# Altium schematic sheet PC104.SchDoc
size A3; SheetNumber: 8; SheetTotal: 8
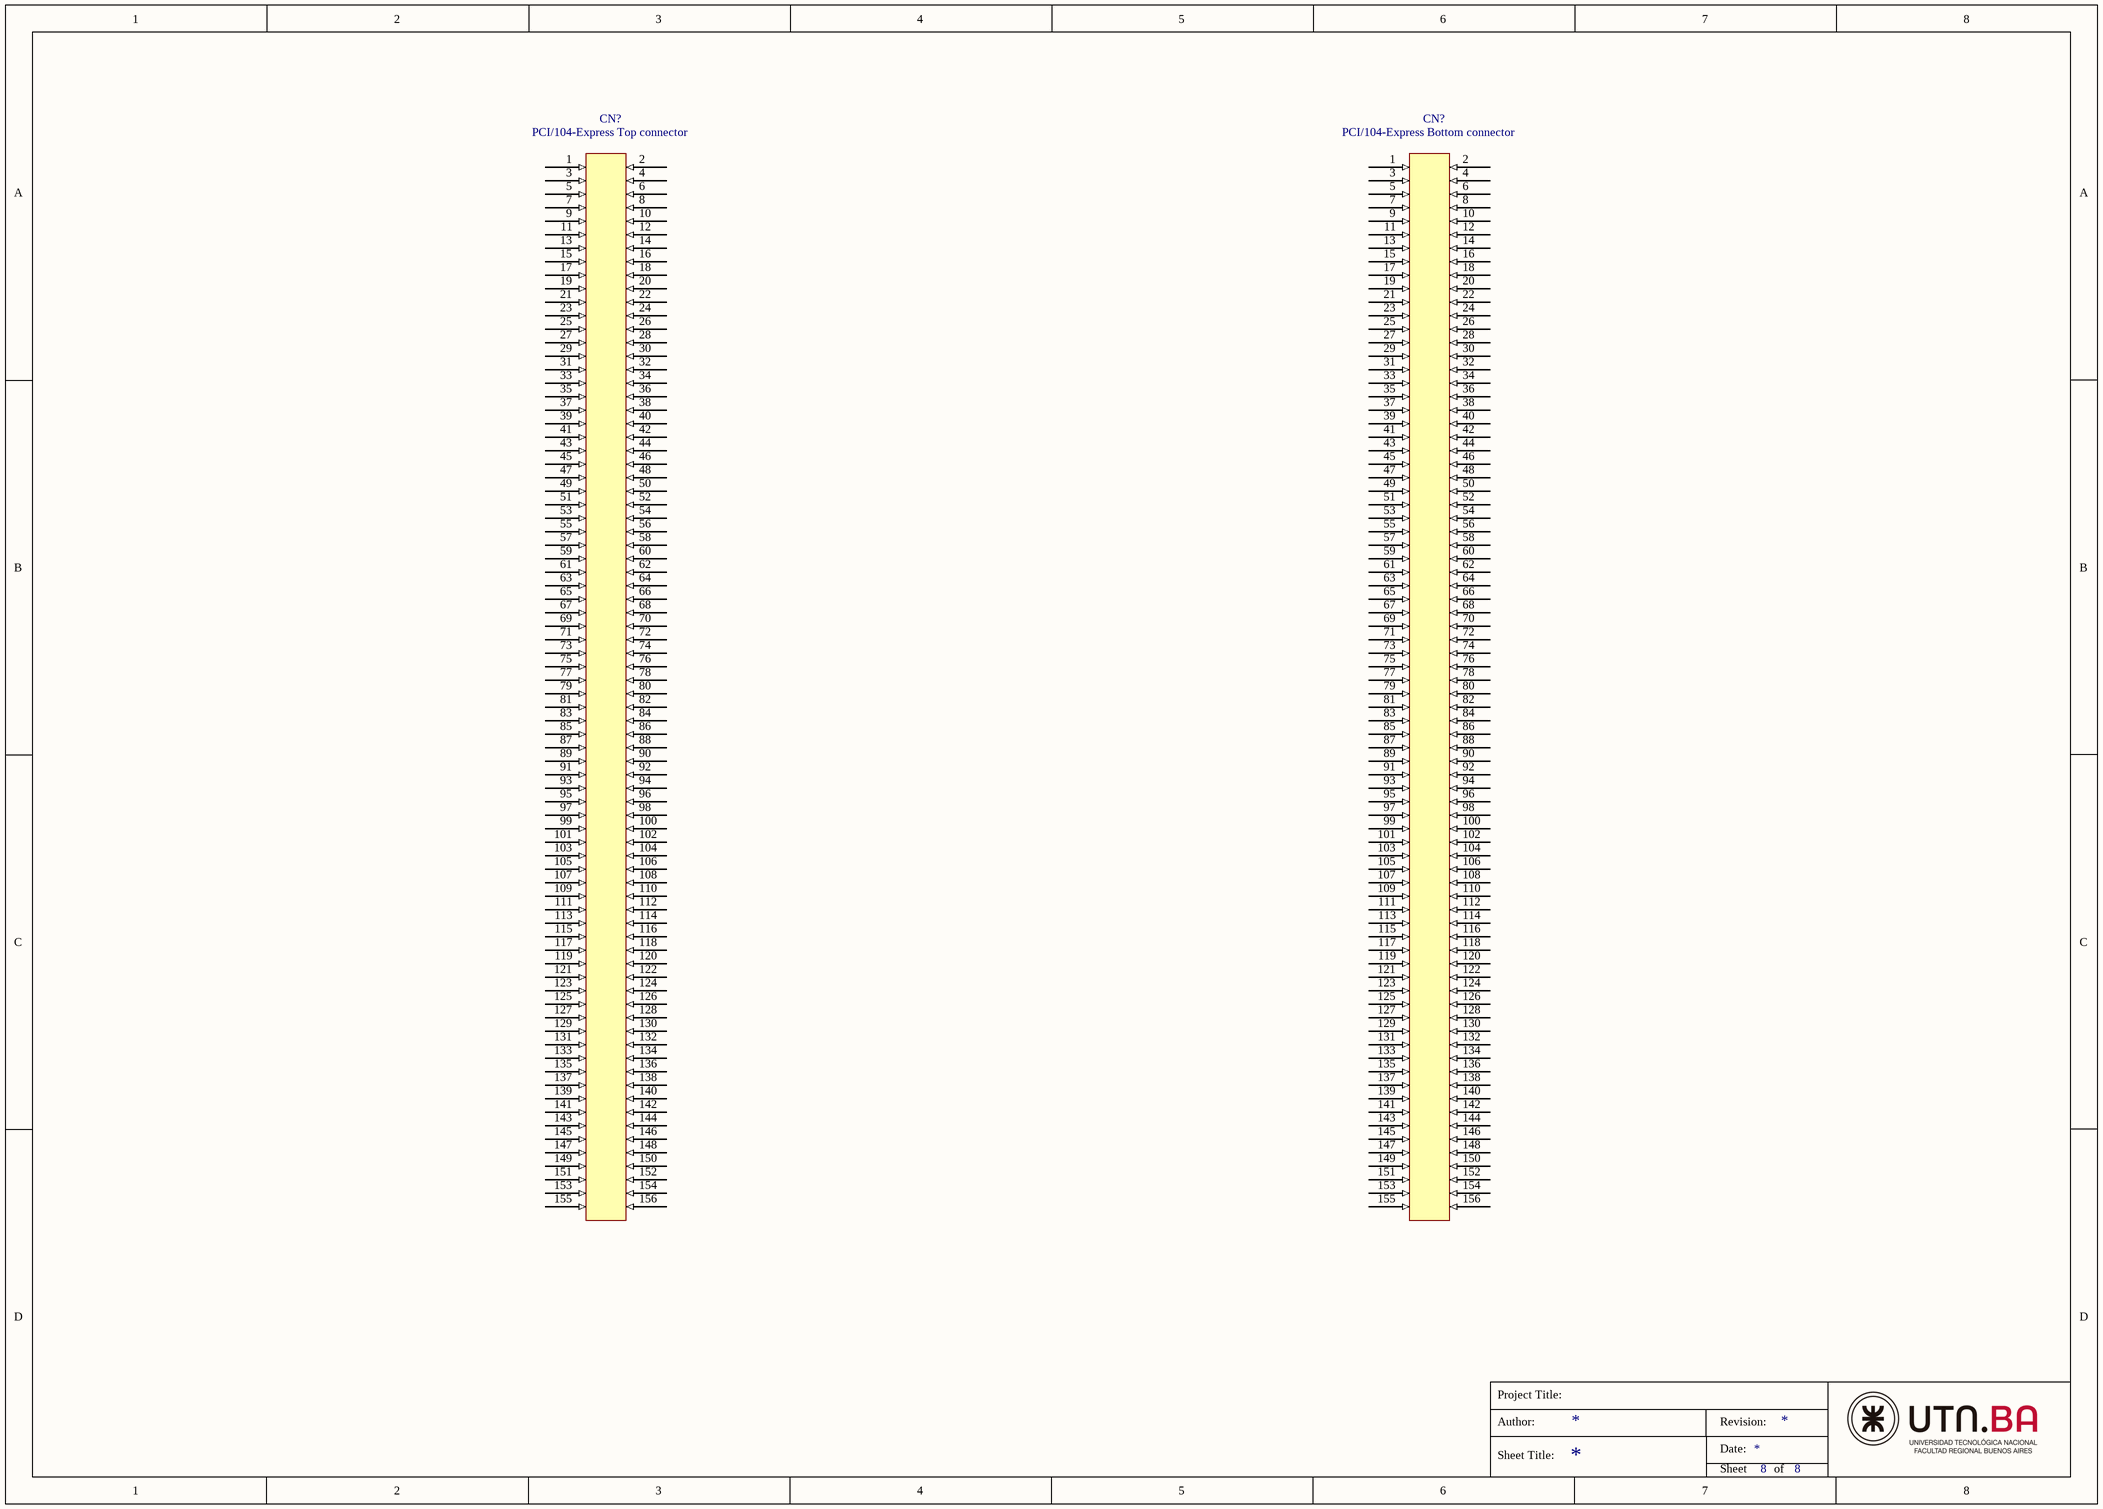
[diagram p0: PC104.SchDoc]

## Parts
(Parts that share a designator on the sheet are numbered #1, #2 ... from top to bottom, then left to right.)
CN?#1  PCI/104-Express Top connector
CN?#2  PCI/104-Express Bottom connector

## Nets

Not connected (* = marked no-connect by the designer): CN?#1 1 2 3 4 5 6 7 8 9 10 11 12 13 14 15 16 17 18 19 20 21 22 23 24 25 26 27 28 29 30 31 32 33 34 35 36 37 38 39 40 41 42 43 44 45 46 47 48 49 50 51 52 53 54 55 56 57 58 59 60 61 62 63 64 65 66 67 68 69 70 71 72 73 74 75 76 77 78 79 80 81 82 83 84 85 86 87 88 89 90 91 92 93 94 95 96 97 98 99 100 101 102 103 104 105 106 107 108 109 110 111 112 113 114 115 116 117 118 119 120 121 122 123 124 125 126 127 128 129 130 131 132 133 134 135 136 137 138 139 140 141 142 143 144 145 146 147 148 149 150 151 152 153 154 155 156; CN?#2 1 2 3 4 5 6 7 8 9 10 11 12 13 14 15 16 17 18 19 20 21 22 23 24 25 26 27 28 29 30 31 32 33 34 35 36 37 38 39 40 41 42 43 44 45 46 47 48 49 50 51 52 53 54 55 56 57 58 59 60 61 62 63 64 65 66 67 68 69 70 71 72 73 74 75 76 77 78 79 80 81 82 83 84 85 86 87 88 89 90 91 92 93 94 95 96 97 98 99 100 101 102 103 104 105 106 107 108 109 110 111 112 113 114 115 116 117 118 119 120 121 122 123 124 125 126 127 128 129 130 131 132 133 134 135 136 137 138 139 140 141 142 143 144 145 146 147 148 149 150 151 152 153 154 155 156

## Notes on the sheet
- Project Title:
- Author:
- Sheet Title:
- Date:
- Revision:
- Sheet
- of

## Library data of the parts
CN?#1 = ASP-129637-03: Manufacturer: Samtec Inc.; ComponentLink1Description: Datasheet; ComponentLink1URL: http://suddendocs.samtec.com/prints/asp-129637-03-mkt.pdf; ComponentLink2Description: SupplierLink; ComponentLink2URL: https://www.digikey.com/en/products/detail/samtec-inc/ASP-129637-03/6561489?s=N4IgTCBcDaIIIGUAKBaAjGAnANgMwHYUAGXEAXQF8g; MPN: ASP-129637-03; Package: Connector; Price (USD): 30; Supplier: Digikey; Value: Top
CN?#2 = ASP-129646-03: Manufacturer: Samtec Inc.; ComponentLink1Description: Datasheet; ComponentLink1URL: http://suddendocs.samtec.com/prints/asp-129646-03-mkt.pdf; ComponentLink2Description: SupplierLink; ComponentLink2URL: https://www.digikey.com/es/products/detail/samtec-inc/ASP-129646-03/6561490; MPN: ASP-129646-03; Package: Connector; Price (USD): 30; Supplier: Digikey; Value: Bottom